# Altium schematic sheet [3]-MAIN.SchDoc
size A4
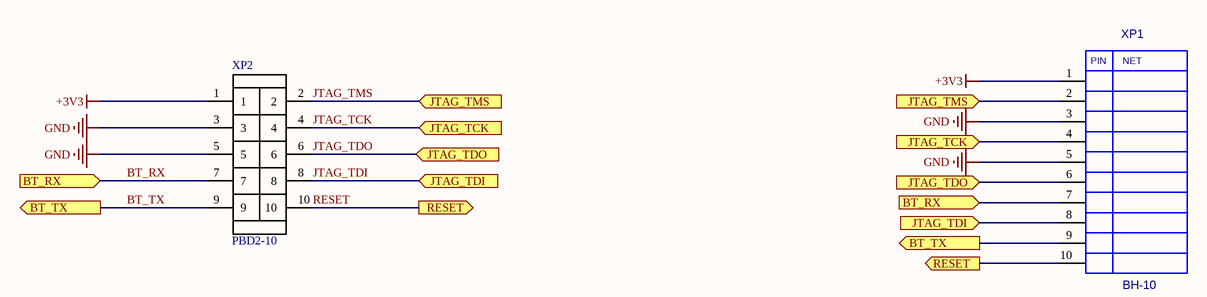
[diagram p0: [3]-MAIN.SchDoc]

## Parts
XP1  BH-10  [BH-10]
XP2  PBD2-10  [PLD2-10]

## Ports
BT_RX (in), BT_TX (out), JTAG_TCK (in), JTAG_TDI (in), JTAG_TDO (in), JTAG_TMS (in), RESET (out)

## Nets
+3V3: XP1.1 XP2.1
GND: XP1.3 XP1.5 XP2.3 XP2.5
BT_RX: XP1.7 XP2.7 ; port BT_RX
BT_TX: XP1.9 XP2.9 ; port BT_TX
JTAG_TCK: XP1.4 XP2.4 ; port JTAG_TCK
JTAG_TDI: XP1.8 XP2.8 ; port JTAG_TDI
JTAG_TDO: XP1.6 XP2.6 ; port JTAG_TDO
JTAG_TMS: XP1.2 XP2.2 ; port JTAG_TMS
RESET: XP1.10 XP2.10 ; port RESET

## Notes on the sheet
- (in symbol BH-10) PIN; NET

## Library data of the parts
XP2 = PLD2-10: Value: PBD2-10
XP1 = BH-10: Value: *